# Altium schematic sheet Common.SchDoc
size A
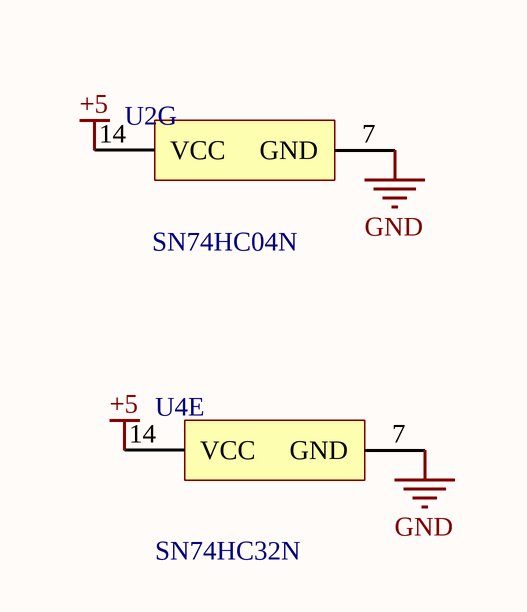
[diagram p0: Common.SchDoc]

## Parts
U2  SN74HC04N  [N0014A]  (part G of 7)
U4  SN74HC32N  [N0014A]  (part E of 5)

## Nets
+5: U2.14(VCC) U4.14(VCC)
GND: U2.7(GND) U4.7(GND)

## Library data of the parts
U2 = CMP-1615-00892-2: Hex Inverters, N0014A, TUBE; Manufacturer: Texas Instruments; VCC(Min)(V): 2; Bits(#): 6; Technology Family: HC; tpd @ Nom Voltage(Max)(ns): 20; Output Drive (IOL/IOH)(Max)(mA): -4/4; Rating: Catalog; Voltage(Nom)(V): 5; Schmitt Trigger: No; ICC @ Nom Voltage(Max)(mA): 0.02; Input Type: CMOS; Code_JEDEC: MS-001; PackageReference: N0014A; DatasheetVersion: SCLS078F; Output Type: CMOS; VCC(Max)(V): 6; Operating Temperature Range(C): -40 to 85; Generic Part Number: SN74HC04; F @ Nom Voltage(Max)(Mhz): 20
U4 = CMP-1573-00148-3: Quadruple 2-Input Positive-OR Gates, N0014A, TUBE; Manufacturer: Texas Instruments; Output Type: CMOS; Rating: Catalog; ICC @ Nom Voltage(Max)(mA): 0.02; VCC(Min)(V): 2; VCC(Max)(V): 6; Bits(#): 4; tpd @ Nom Voltage(Max)(ns): 25; Voltage(Nom)(V): 5; F @ Nom Voltage(Max)(Mhz): 70; Output Drive (IOL/IOH)(Max)(mA): 5.2/-5.2; PackageVersion: http://www.ti.com/lit/ml/mpdi002c/mpdi002c.pdf; Operating Temperature Range(C): -40 to 85; Code_JEDEC: MS-001; DatasheetVersion: SCLS200D; Generic Part Number: SN74HC32; Input Type: CMOS; PackageReference: N0014A